# Altium schematic sheet M.2 E-KEY.SchDoc: M.2 E-Key Connector
size 431 x 279 mm; CheckedBy: Lance Bantoto; Engineer: Cindy Li; DocumentNumber: 18; Revision: 1; SheetNumber: 18; SheetTotal: 23
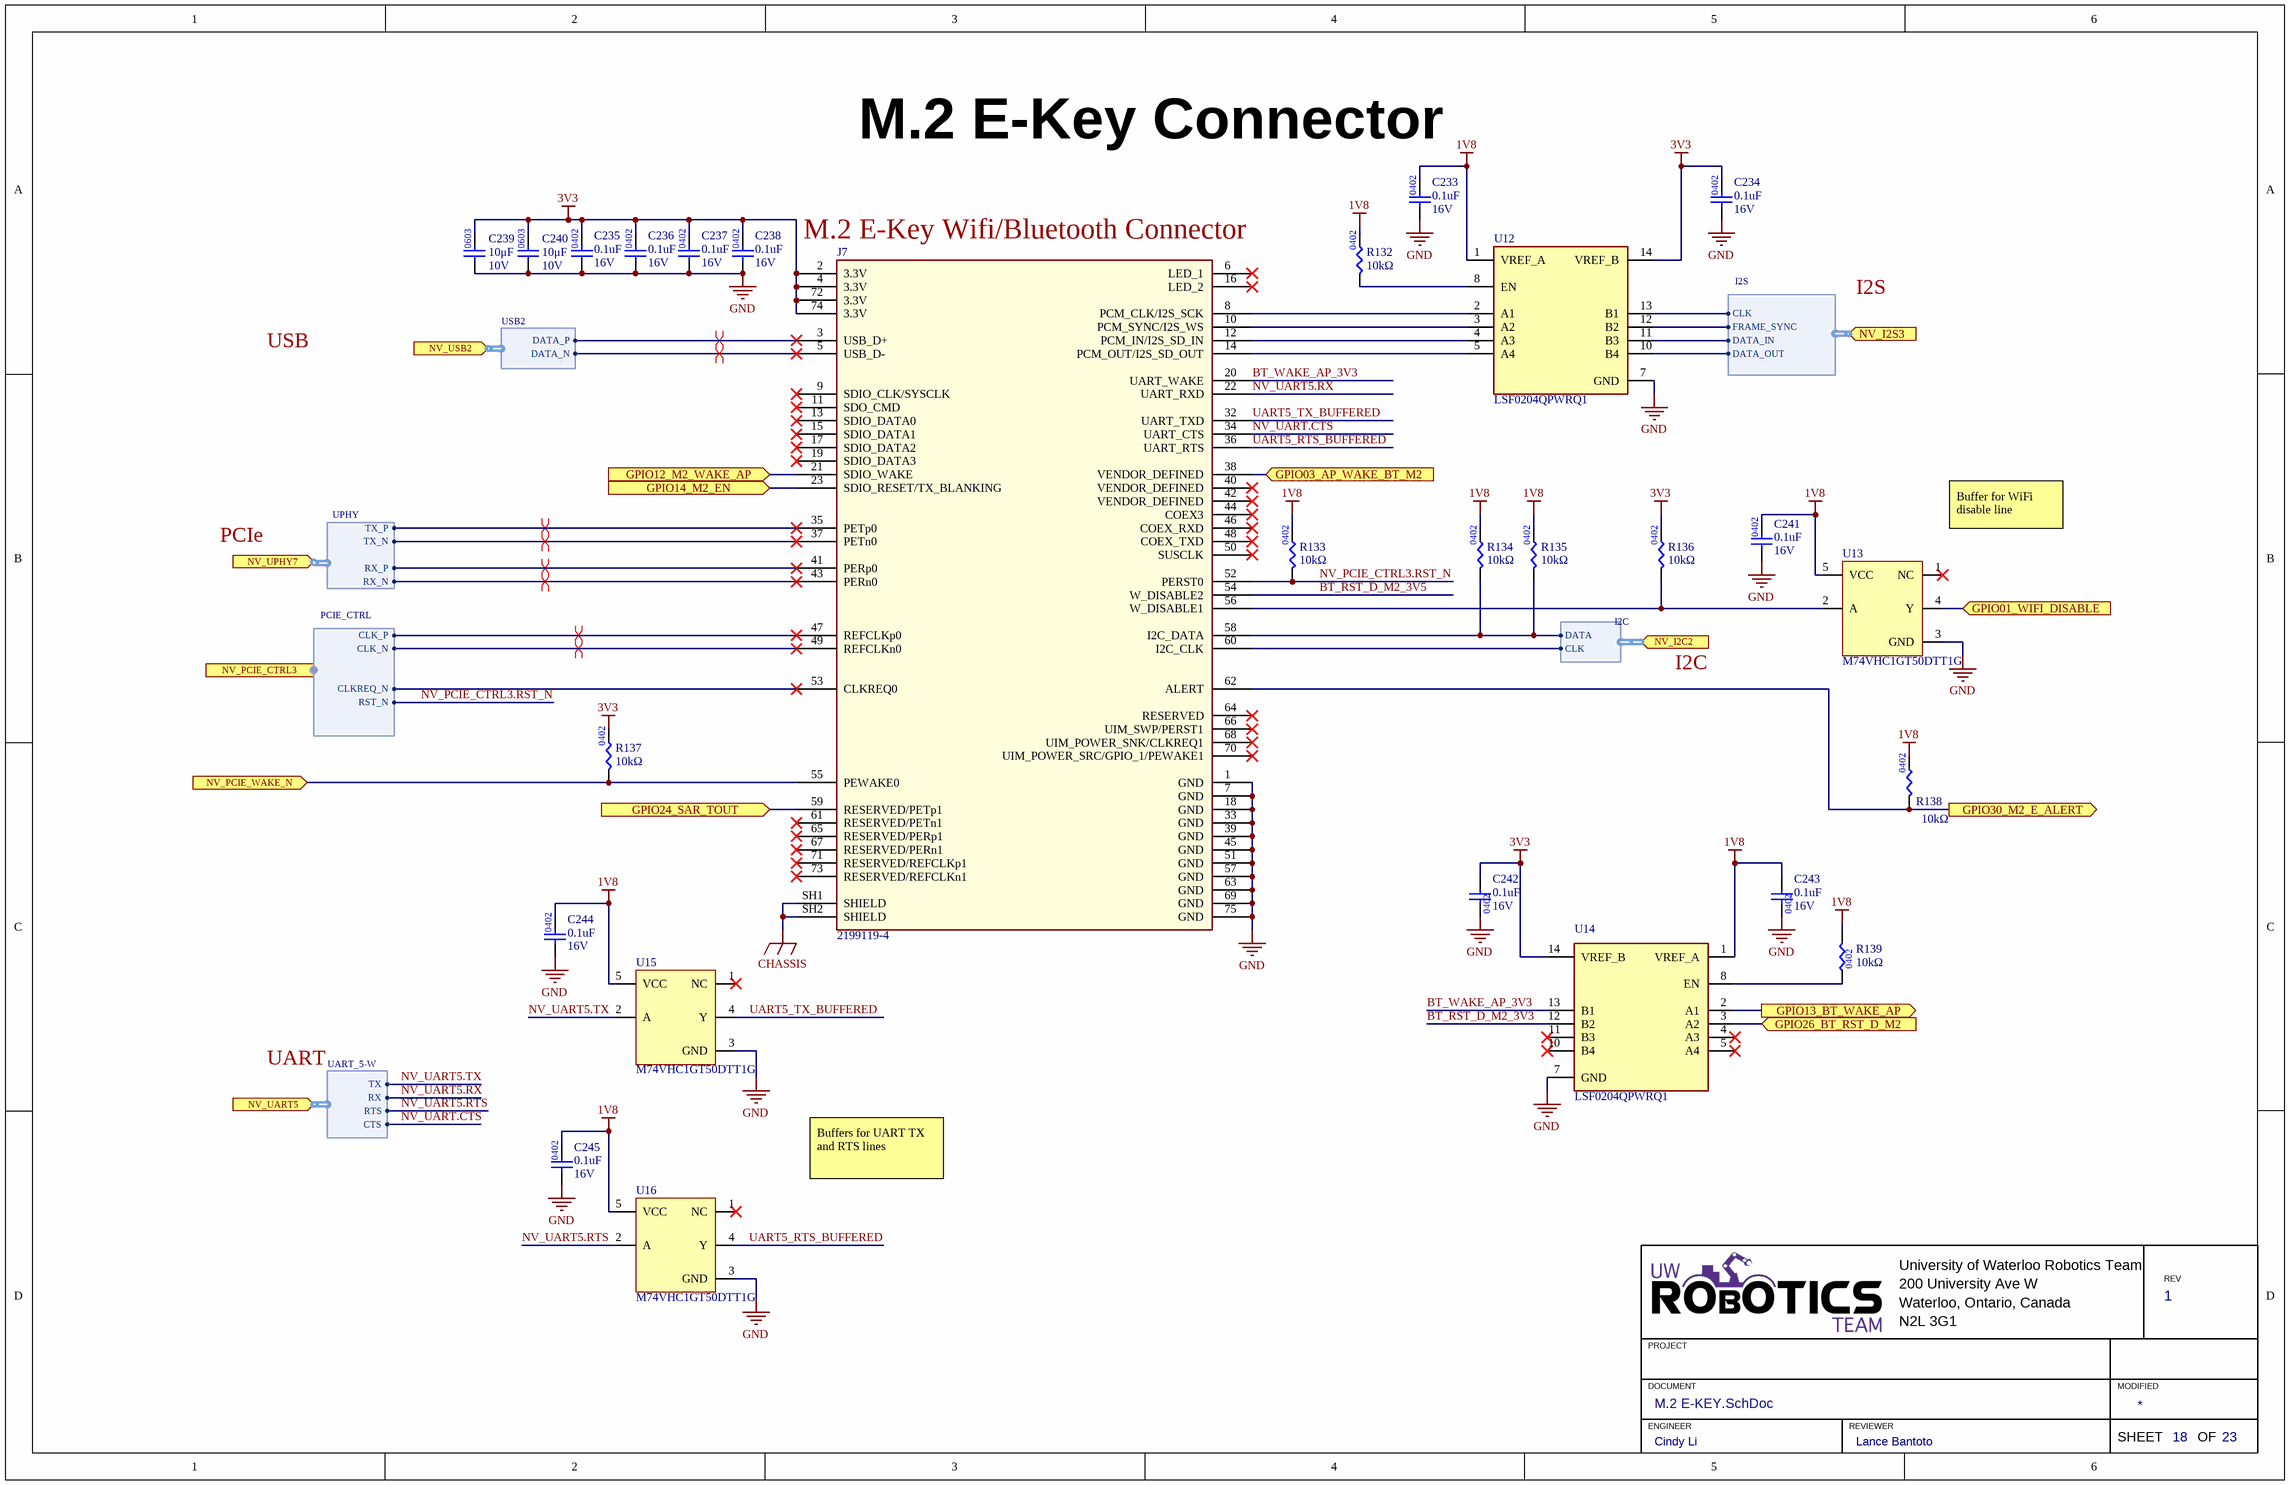
[diagram p0: M.2 E-KEY.SchDoc]

## Parts
C233  Capacitance: 0.1uF  Voltage Rating: 16V  [CAP0402]  (hidden comment: CAP_0.1uF_16V_X7R_0402)
C234  Capacitance: 0.1uF  Voltage Rating: 16V  [CAP0402]  (hidden comment: CAP_0.1uF_16V_X7R_0402)
C235  Capacitance: 0.1uF  Voltage Rating: 16V  [CAP0402]  (hidden comment: CAP_0.1uF_16V_X7R_0402)
C236  Capacitance: 0.1uF  Voltage Rating: 16V  [CAP0402]  (hidden comment: CAP_0.1uF_16V_X7R_0402)
C237  Capacitance: 0.1uF  Voltage Rating: 16V  [CAP0402]  (hidden comment: CAP_0.1uF_16V_X7R_0402)
C238  Capacitance: 0.1uF  Voltage Rating: 16V  [CAP0402]  (hidden comment: CAP_0.1uF_16V_X7R_0402)
C239  value 10μF  Voltage Rating: 10V  [CAP0603]  (hidden comment: CAP_10uF_10V_0603)
C240  value 10μF  Voltage Rating: 10V  [CAP0603]  (hidden comment: CAP_10uF_10V_0603)
C241  Capacitance: 0.1uF  Voltage Rating: 16V  [CAP0402]  (hidden comment: CAP_0.1uF_16V_X7R_0402)
C242  Capacitance: 0.1uF  Voltage Rating: 16V  [CAP0402]  (hidden comment: CAP_0.1uF_16V_X7R_0402)
C243  Capacitance: 0.1uF  Voltage Rating: 16V  [CAP0402]  (hidden comment: CAP_0.1uF_16V_X7R_0402)
C244  Capacitance: 0.1uF  Voltage Rating: 16V  [CAP0402]  (hidden comment: CAP_0.1uF_16V_X7R_0402)
C245  Capacitance: 0.1uF  Voltage Rating: 16V  [CAP0402]  (hidden comment: CAP_0.1uF_16V_X7R_0402)
J7  2199119-4  [TE_2199119-4]
R132  Resistance: 10kΩ  [RES0402]  (hidden comment: RES_10kΩ_0402_1%)
R133  Resistance: 10kΩ  [RES0402]  (hidden comment: RES_10kΩ_0402_1%)
R134  Resistance: 10kΩ  [RES0402]  (hidden comment: RES_10kΩ_0402_1%)
R135  Resistance: 10kΩ  [RES0402]  (hidden comment: RES_10kΩ_0402_1%)
R136  Resistance: 10kΩ  [RES0402]  (hidden comment: RES_10kΩ_0402_1%)
R137  Resistance: 10kΩ  [RES0402]  (hidden comment: RES_10kΩ_0402_1%)
R138  Resistance: 10kΩ  [RES0402]  (hidden comment: RES_10kΩ_0402_1%)
R139  Resistance: 10kΩ  [RES0402]  (hidden comment: RES_10kΩ_0402_1%)
U12  LSF0204QPWRQ1  [14-TSSOP]
U13  Manufacturer Part Number 1: M74VHC1GT50DTT1G  [SOT23-5]  (hidden comment: IC_BUFFER)
U14  LSF0204QPWRQ1  [14-TSSOP]
U15  Manufacturer Part Number 1: M74VHC1GT50DTT1G  [SOT23-5]  (hidden comment: IC_BUFFER)
U16  Manufacturer Part Number 1: M74VHC1GT50DTT1G  [SOT23-5]  (hidden comment: IC_BUFFER)

## Ports
GPIO01_WIFI_DISABLE (in), GPIO03_AP_WAKE_BT_M2 (in), GPIO12_M2_WAKE_AP (in), GPIO13_BT_WAKE_AP (out), GPIO14_M2_EN (in), GPIO24_SAR_TOUT (in), GPIO26_BT_RST_D_M2 (in), GPIO30_M2_E_ALERT (out), NV_I2C2 (in, harness I2C), NV_I2S3 (in, harness I2S), NV_PCIE_CTRL3 (in, harness PCIE_CTRL), NV_PCIE_WAKE_N (in), NV_UART5 (in, harness UART_5-W), NV_UPHY7 (in, harness UPHY), NV_USB2 (in, harness USB2)

## Harnesses
UPHY: TX_P, TX_N, RX_P, RX_N
PCIE_CTRL: CLK_P, CLK_N, RST_N, CLKREQ_N
I2C: CLK, DATA
I2S: CLK, FRAME_SYNC, DATA_IN, DATA_OUT
UART_5-W: TX, RX, RTS, CTS
USB2: DATA_P, DATA_N

## Nets
1V8: C233.2 C241.2 C243.2 C244.2 C245.2 R132.2 R133.2 R134.2 R135.2 R138.2 R139.2 U12.1(VREF_A) U13.5(VCC) U14.1(VREF_A) U15.5(VCC) U16.5(VCC)
3V3: C234.2 C235.2 C236.2 C237.2 C238.2 C239.2 C240.2 C242.2 J7.2(3.3V) J7.4(3.3V) J7.72(3.3V) J7.74(3.3V) R136.2 R137.2 U12.14(VREF_B) U14.14(VREF_B)
CHASSIS: J7.SH1(SHIELD) J7.SH2(SHIELD)
GND: C233.1 C234.1 C235.1 C236.1 C237.1 C238.1 C239.1 C240.1 C241.1 C242.1 C243.1 C244.1 C245.1 J7.1(GND) J7.7(GND) J7.18(GND) J7.33(GND) J7.39(GND) J7.45(GND) J7.51(GND) J7.57(GND) J7.63(GND) J7.69(GND) J7.75(GND) U12.7(GND) U13.3(GND) U14.7(GND) U15.3(GND) U16.3(GND)
BT_RST_D_M2_3V3: U14.12(B2)
BT_RST_D_M2_3V5: J7.54(W_DISABLE2)
BT_WAKE_AP_3V3: J7.20(UART_WAKE) U14.13(B1)
GPIO01_WIFI_DISABLE: U13.4(Y) ; port GPIO01_WIFI_DISABLE
GPIO03_AP_WAKE_BT_M2: J7.38(VENDOR_DEFINED) ; port GPIO03_AP_WAKE_BT_M2
GPIO12_M2_WAKE_AP: J7.21(SDIO_WAKE) ; port GPIO12_M2_WAKE_AP
GPIO13_BT_WAKE_AP: U14.2(A1) ; port GPIO13_BT_WAKE_AP
GPIO14_M2_EN: J7.23(SDIO_RESET/TX_BLANKING) ; port GPIO14_M2_EN
GPIO24_SAR_TOUT: J7.59(RESERVED/PETp1) ; port GPIO24_SAR_TOUT
GPIO26_BT_RST_D_M2: U14.3(A2) ; port GPIO26_BT_RST_D_M2
GPIO30_M2_E_ALERT: J7.62(ALERT) R138.1 ; port GPIO30_M2_E_ALERT
NV_PCIE_CTRL3.RST_N: J7.52(PERST0) R133.1 ; port NV_PCIE_CTRL3.RST_N
NV_PCIE_WAKE_N: J7.55(PEWAKE0) R137.1 ; port NV_PCIE_WAKE_N
NV_UART5.RTS: U16.2(A) ; port NV_UART5.RTS
NV_UART5.RX: J7.22(UART_RXD) ; port NV_UART5.RX
NV_UART5.TX: U15.2(A) ; port NV_UART5.TX
NV_UART.CTS: J7.34(UART_CTS) ; port NV_UART5.CTS
UART5_RTS_BUFFERED: J7.36(UART_RTS) U16.4(Y)
UART5_TX_BUFFERED: J7.32(UART_TXD) U15.4(Y)
NetJ7_3: J7.3(USB_D+) ; port NV_USB2.DATA_P
NetJ7_5: J7.5(USB_D-) ; port NV_USB2.DATA_N
NetJ7_8: J7.8(PCM_CLK/I2S_SCK) U12.2(A1)
NetJ7_10: J7.10(PCM_SYNC/I2S_WS) U12.3(A2)
NetJ7_12: J7.12(PCM_IN/I2S_SD_IN) U12.4(A3)
NetJ7_14: J7.14(PCM_OUT/I2S_SD_OUT) U12.5(A4)
NetJ7_35: J7.35(PETp0) ; port NV_UPHY7.TX_P
NetJ7_37: J7.37(PETn0) ; port NV_UPHY7.TX_N
NetJ7_41: J7.41(PERp0) ; port NV_UPHY7.RX_P
NetJ7_43: J7.43(PERn0) ; port NV_UPHY7.RX_N
NetJ7_47: J7.47(REFCLKp0) ; port NV_PCIE_CTRL3.CLK_P
NetJ7_49: J7.49(REFCLKn0) ; port NV_PCIE_CTRL3.CLK_N
NetJ7_53: J7.53(CLKREQ0) ; port NV_PCIE_CTRL3.CLKREQ_N
NetJ7_56: J7.56(W_DISABLE1) R136.1 U13.2(A)
NetJ7_58: J7.58(I2C_DATA) R134.1 R135.1 ; port NV_I2C2.DATA
NetJ7_60: J7.60(I2C_CLK) ; port NV_I2C2.CLK
NetR132_1: R132.1 U12.8(EN)
NetR139_1: R139.1 U14.8(EN)
NetU12_10: U12.10(B4) ; port NV_I2S3.DATA_OUT
NetU12_11: U12.11(B3) ; port NV_I2S3.DATA_IN
NetU12_12: U12.12(B2) ; port NV_I2S3.FRAME_SYNC
NetU12_13: U12.13(B1) ; port NV_I2S3.CLK

Not connected (* = marked no-connect by the designer): J7 6(LED_1)* 9(SDIO_CLK/SYSCLK)* 11(SDO_CMD)* 13(SDIO_DATA0)* 15(SDIO_DATA1)* 16(LED_2)* 17(SDIO_DATA2)* 19(SDIO_DATA3)* 40(VENDOR_DEFINED)* 42(VENDOR_DEFINED)* 44(COEX3)* 46(COEX_RXD)* 48(COEX_TXD)* 50(SUSCLK)* 61(RESERVED/PETn1)* 64(RESERVED)* 65(RESERVED/PERp1)* 66(UIM_SWP/PERST1)* 67(RESERVED/PERn1)* 68(UIM_POWER_SNK/CLKREQ1)* 70(UIM_POWER_SRC/GPIO_1/PEWAKE1)* 71(RESERVED/REFCLKp1)* 73(RESERVED/REFCLKn1)*; U13 1(NC)*; U14 4(A3)* 5(A4)* 10(B4)* 11(B3)*; U15 1(NC)*; U16 1(NC)*

## Layout directives
differential pair: NetJ7_3, NetJ7_5, NetJ7_35, NetJ7_37, NetJ7_41, NetJ7_43, NetJ7_47, NetJ7_49

## Notes on the sheet
- (near J7) M.2 E-Key Wifi/Bluetooth Connector
- I2S
- USB
- PCIe
- Buffer for WiFi disable line
- I2C
- UART
- Buffers for UART TX and RTS lines
- University of Waterloo Robotics Team
- 200 University Ave W
- REV
- PROJECT
- Waterloo, Ontario, Canada
- N2L 3G1
- DOCUMENT
- ENGINEER
- REVIEWER
- MODIFIED
- SHEET
- OF
- (in symbol CAP_10uF_10V_0603) 0603

## Library data of the parts
C233-C238 C241-C245 = CAP_0.1uF_16V_X7R_0402: CAP CER 0.1UF 16V X7R 0402; Supplier 1: Digi-Key; Mounting Type: Surface Mount; Package: 0402
C239 C240 = CAP_10uF_10V_0603: CAP CER 10UF 10V X5R 0603; Manufacturer 1: Yageo; Manufacturer Part Number 1: CC0603MRX5R6BB106; Supplier Part Number 1: 311-1817-1-ND; Supplier 1: Digi-Key; Dielectric: X5R
J7 = 2199119-4: CONN M.2 FEMALE 67POS 0.020 GOLD; Manufacturer 1: TE Connectivity; Number of Positions: 67; Pitch: 0.020" (0.50mm); Supplier 1: Digi-Key; Supplier Part Number 1: A115900CT-ND; Gender: Female; Manufacturer Part Number 1: 2199119-4
R132 R133 R137-R139 = RES_10kΩ_0402_1%: RES 10K OHM 1% 1/16W 0402; Manufacturer Part Number 1: RC1005F103CS; Manufacturer 1: Samsung Electro-Mechanics; Supplier 1: Digi-Key; Supplier Part Number 1: 1276-3431-1-ND; Tolerance: 1%; Package: 0402
R134-R136 = RES_10kΩ_0402_1%: RES 10K OHM 1% 1/16W 0402; Manufacturer 1: Samsung Electro-Mechanics; Manufacturer Part Number 1: RC1005F103CS; Supplier Part Number 1: 1276-3431-1-ND; Supplier 1: Digi-Key; Tolerance: 1%; Package: 0402
U12 U14 = LSF0204QPWRQ1: 4-BITS MULTI-VOLTAGE LEVEL TRANS; Manufacturer 1: Texas Instruments; Channel Type: Bidirectional; Channels per Circuit: 4; Output Type: Open Drain, Push Pull; Data Rate: 100MBd; Voltage - VCCA: 0.8V - 4.5V; Voltage - VCCB: 1.8V - 5.5V; Manufacturer Part Number 1: LSF0204QPWRQ1; Supplier 1: Digi-Key; Supplier Part Number 1: 296-51425-1-ND; Package: 14-TSSOP
U13 U15 U16 = IC_BUFFER: IC BUFFER NON-INVERT 5.5V 5TSOP; Manufacturer 1: onsemi; Package/Footprint: TSOP-5; Supplier 1: Digi-Key; Mounting Type: SMD; Supplier Part Number 1: M74VHC1GT50DTT1GOSCT-ND